# EAGLE design logger (EAGLE 6.4)
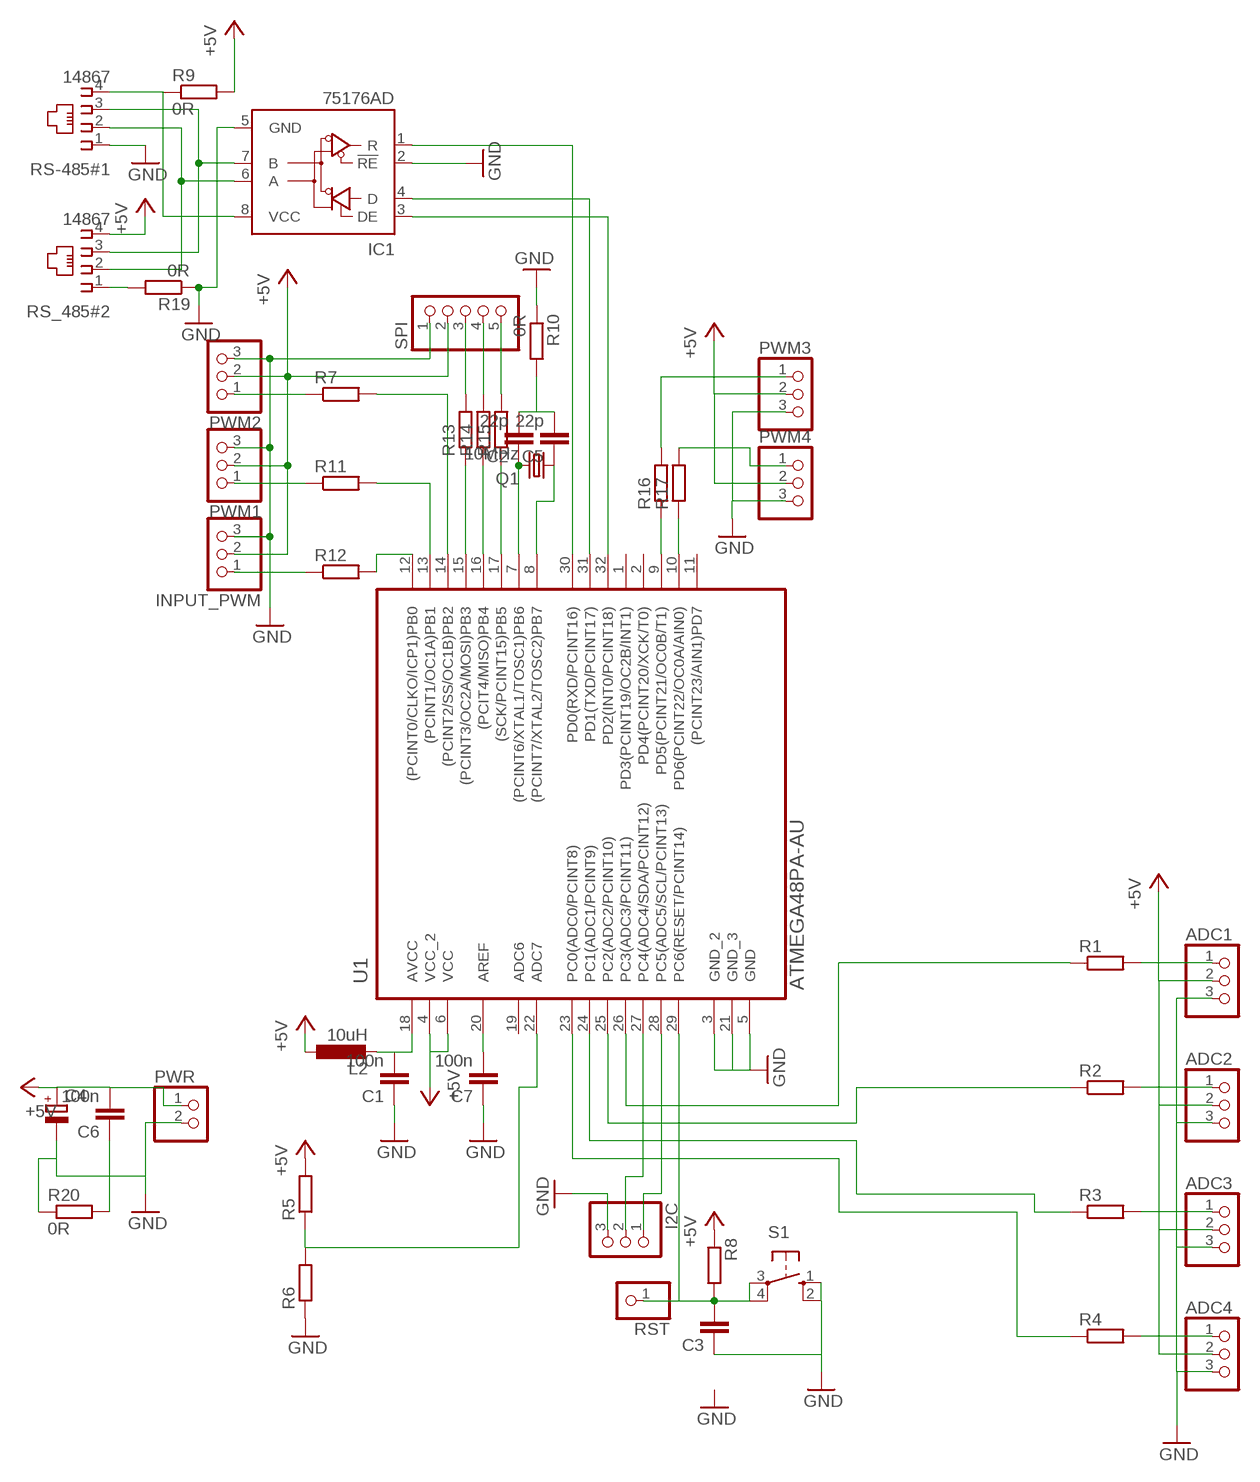
[diagram p0: schematic, sheet 1]

## Parts
ADC1  PINHD-1X3  [1X03]
ADC2  PINHD-1X3  [1X03]
ADC3  PINHD-1X3  [1X03]
ADC4  PINHD-1X3  [1X03]
C1  100n  C-EUC0805  [C0805]
C2  22p  C-EUC0805  [C0805]
C3  C-EUC0805  [C0805]
C4  CPOL-EUE2,5-6E  [E2,5-6E]
C5  22p  C-EUC0805  [C0805]
C6  100n  C-EUC0805  [C0805]
C7  100n  C-EUC0805  [C0805]
I2C  PINHD-1X3  [1X03]
IC1  75176AD  [D_R-PDSO-G8]
INPUT_PWM  PINHD-1X3  [1X03]
L2  10uH  L-EU  [L1206]
PWM1  PINHD-1X3  [1X03]
PWM2  PINHD-1X3  [1X03]
PWM3  PINHD-1X3  [1X03]
PWM4  PINHD-1X3  [1X03]
PWR  PINHD-1X2  [1X02]
Q1  10MHz  CRYSTALHC49U-V  [HC49U-V]
R1  R-EU_R0805  [R0805]
R2  R-EU_R0805  [R0805]
R3  R-EU_R0805  [R0805]
R4  R-EU_R0805  [R0805]
R5  R-EU_R0805  [R0805]
R6  R-EU_R1206  [R1206]
R7  R-EU_R0805  [R0805]
R8  R-EU_R0805  [R0805]
R9  0R  R-EU_R1206  [R1206]
R10  0R  R-EU_R1206  [R1206]
R11  R-EU_R0805  [R0805]
R12  R-EU_R0805  [R0805]
R13  R-EU_R0805  [R0805]
R14  R-EU_R0805  [R0805]
R15  R-EU_R0805  [R0805]
R16  R-EU_R0805  [R0805]
R17  R-EU_R0805  [R0805]
R19  0R  R-EU_R1206  [R1206]
R20  0R  R-EU_R1206  [R1206]
RS-485#1  14867  [14867]
RS_485#2  14867  [14867]
RST  PINHD-1X1  [1X01]
S1  10-XX  [B3F-10XX]
SPI  PINHD-1X5  [1X05]
U1  ATMEGA48PA-AU  [QFP80P900X900X120-32N]

## Nets
+5V: ADC1.2 ADC2.2 ADC3.2 ADC4.2 C4.+ C6.2 INPUT_PWM.2 L2.1 PWM1.2 PWM2.2 PWM3.2 PWM4.2 PWR.1 R5.2 R8.1 R9.2 RS_485#2.4 SPI.2 U1.4(VCC_2) U1.6(VCC)
DE: IC1.3(DE) U1.32(PD2(INT0/PCINT18))
GND: ADC1.3 ADC2.3 ADC3.3 ADC4.3 C1.1 C3.1 C4.- C6.1 C7.1 I2C.3 IC1.2(!RE) IC1.5(GND) INPUT_PWM.3 PWM1.3 PWM2.3 PWM3.3 PWM4.3 PWR.2 R6.1 R10.1 R19.1 R20.1 R20.2 RS-485#1.1 S1.1(S) S1.2(S1) SPI.1 U1.3(GND_2) U1.5(GND) U1.21(GND_3)
N$1: IC1.6(A) RS-485#1.2 RS_485#2.2
N$2: IC1.7(B) RS-485#1.3 RS_485#2.3
N$3: R5.1 R6.2 U1.22(ADC7)
N$4: R4.1 U1.23(PC0(ADC0/PCINT8))
N$5: ADC4.1 R4.2
N$6: ADC3.1 R3.2
N$7: ADC2.1 R2.2
N$8: ADC1.1 R1.2
N$9: R3.1 U1.24(PC1(ADC1/PCINT9))
N$10: R2.1 U1.25(PC2(ADC2/PCINT10))
N$11: R1.1 U1.26(PC3(ADC3/PCINT11))
N$12: INPUT_PWM.1 R12.1
N$13: R15.2 SPI.5
N$14: R14.2 SPI.4
N$15: C3.2 R8.2 RST.1 S1.3(P) S1.4(P1) U1.29(PC6(RESET/PCINT14))
N$16: C2.1 Q1.2 U1.7((PCINT6/XTAL1/TOSC1)PB6)
N$17: R13.2 SPI.3
N$18: C5.1 Q1.1 U1.8((PCINT7/XTAL2/TOSC2)PB7)
N$19: C1.2 L2.2 U1.18(AVCC)
N$20: IC1.8(VCC) R9.1 RS-485#1.4
N$21: I2C.1 U1.28(PC5(ADC5/SCL/PCINT13))
N$22: I2C.2 U1.27(PC4(ADC4/SDA/PCINT12))
N$23: PWM1.1 R11.1
N$24: PWM2.1 R7.1
N$25: R13.1 U1.15((PCINT3/OC2A/MOSI)PB3)
N$26: R14.1 U1.16((PCIT4/MISO)PB4)
N$27: R16.1 U1.9(PD5(PCINT21/OC0B/T1))
N$28: R17.1 U1.10(PD6(PCINT22/OC0A/AIN0))
N$29: R15.1 U1.17((SCK/PCINT15)PB5)
N$30: R19.2 RS_485#2.1
N$31: R12.2 U1.12((PCINT0/CLKO/ICP1)PB0)
N$32: R11.2 U1.13((PCINT1/OC1A)PB1)
N$33: R7.2 U1.14((PCINT2/SS/OC1B)PB2)
N$34: C7.2 U1.20(AREF)
N$35: C2.2 C5.2 R10.2
N$36: PWM4.1 R17.2
N$37: PWM3.1 R16.2
RX: IC1.1(R) U1.30(PD0(RXD/PCINT16))
TX: IC1.4(D) U1.31(PD1(TXD/PCINT17))
Unconnected: U1.1(PD3(PCINT19/OC2B/INT1)) U1.2(PD4(PCINT20/XCK/T0)) U1.11((PCINT23/AIN1)PD7) U1.19(ADC6)

## Library data of the parts
ADC1-ADC4 I2C INPUT_PWM PWM1-PWM4 = pinhead:PINHD-1X3: PIN HEADER
C1-C3 C5-C7 = rcl:C-EU: CAPACITOR, European symbol
C4 = rcl:CPOL-EU: POLARIZED CAPACITOR, European symbol
IC1 = 751xx:75176A: DIFFERENTIAL BUS TRANSCEIVER Source: http://focus.ti.com/lit/ds/symlink/sn75176a.pdf
L2 = rcl:L-EU: INDUCTOR, European symbol
PWR = pinhead:PINHD-1X2: PIN HEADER
Q1 = crystal:CRYSTAL: CRYSTAL; OC_FARNELL: 1666969; OC_NEWARK: unknown
R1-R17 R19 R20 = rcl:R-EU_: RESISTOR, European symbol
RS-485#1 RS_485#2 = con-4ucon:14867: RJ11 Connector Source: 4UCON TECHNOLOGY INC. 14867.pdf; OC_FARNELL: unknown; OC_NEWARK: unknown
RST = pinhead:PINHD-1X1: PIN HEADER
S1 = switch-omron:10-XX: OMRON SWITCH; MPN: B3F-1000; OC_FARNELL: 176432; OC_NEWARK: 36M3542
SPI = pinhead:PINHD-1X5: PIN HEADER
U1 = atmega48PA:ATMEGA48PA-AU: Microcontroller with Programmable Flash; MPN: ATMEGA48PA-AU; OC_FARNELL: 1715488; OC_NEWARK: 15R0269; PACKAGE: TQFP-32; SUPPLIER: Atmel

## Board
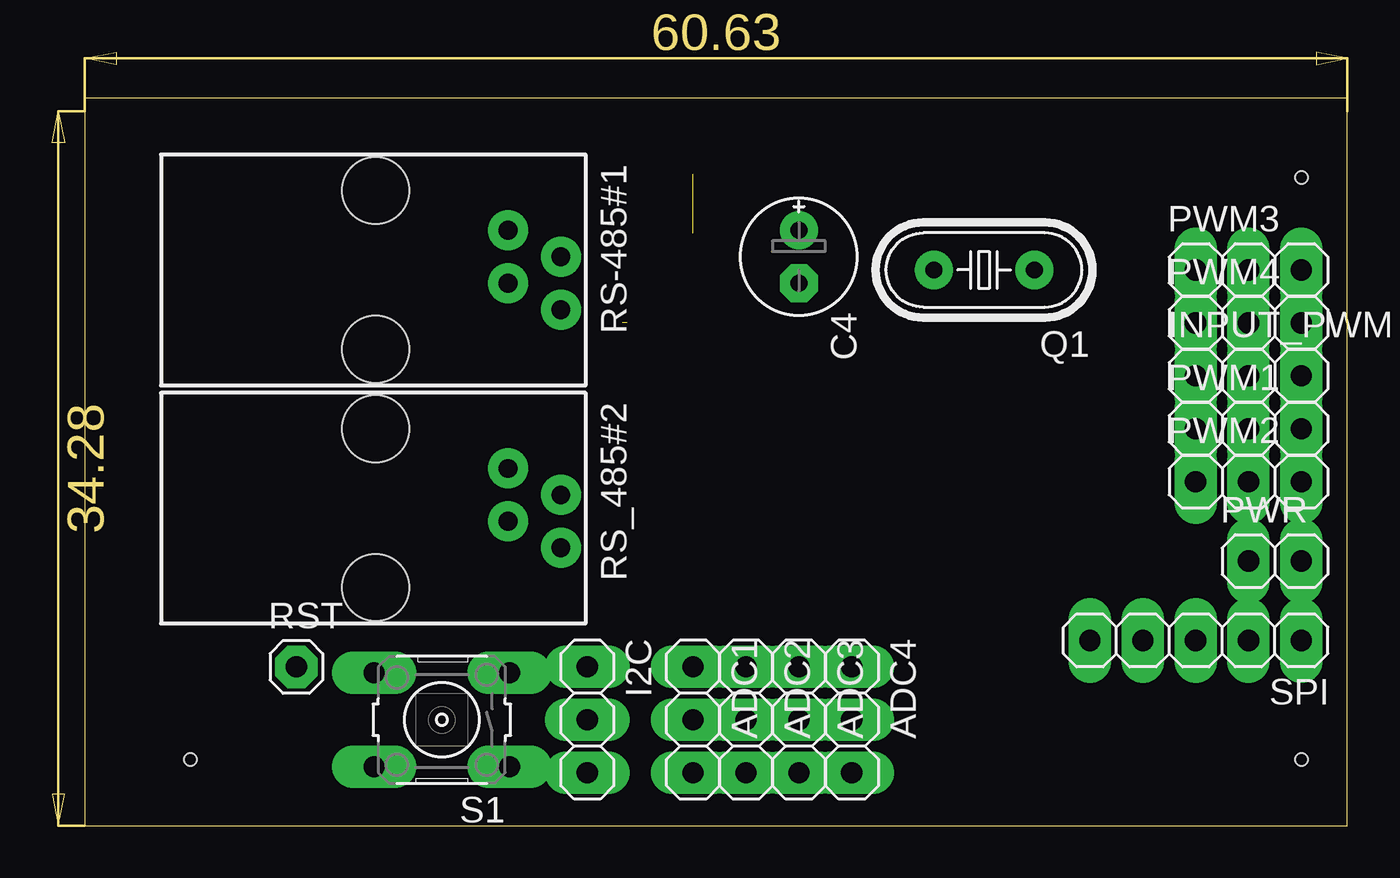
[diagram p1: board, top side]
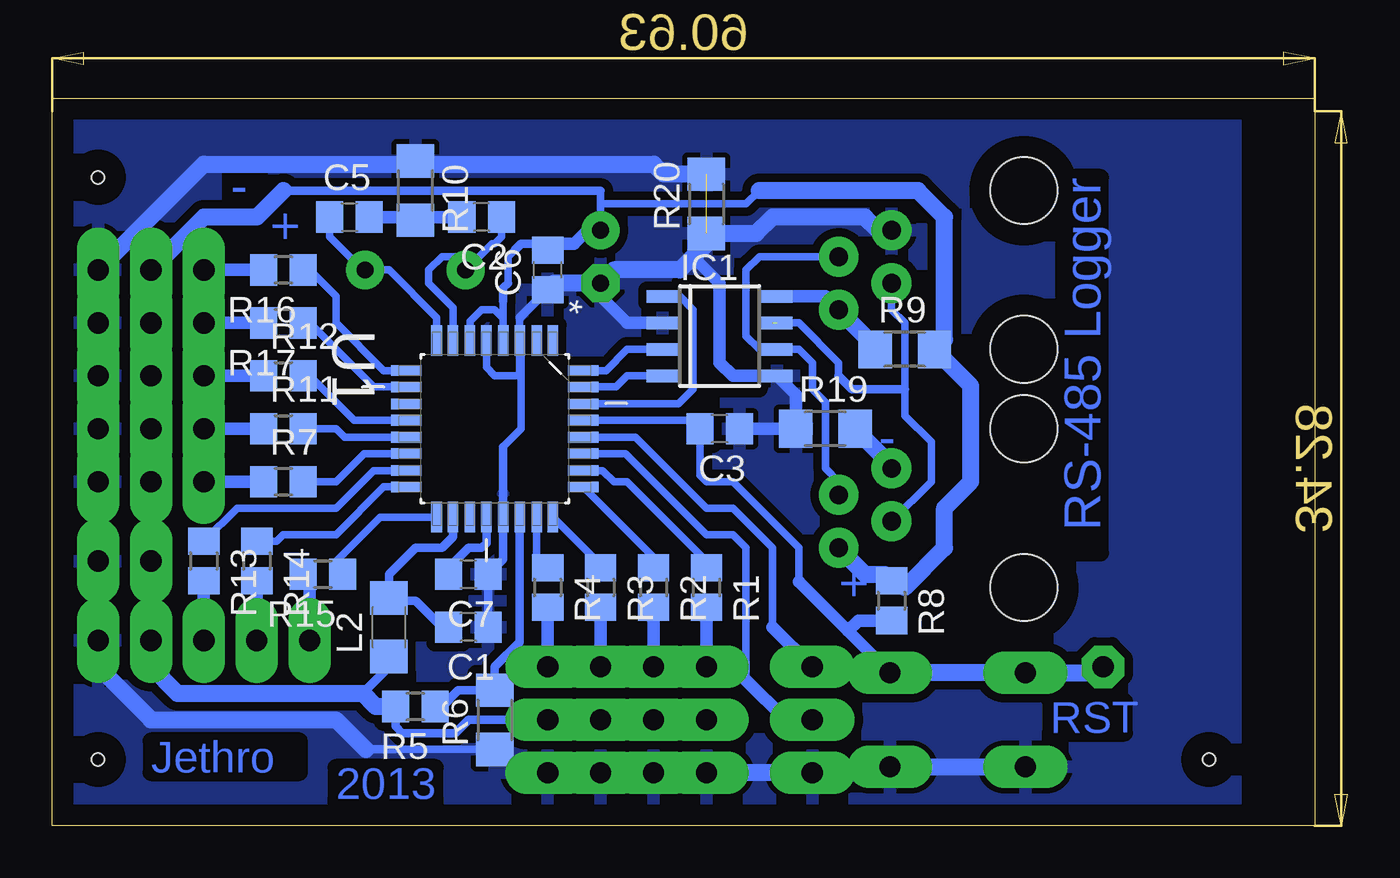
[diagram p2: board, bottom side, seen from below]

Size 60.63 x 34.92 mm. Coordinates in mm from the lower left corner, seen from the top.
Outline: 0,0 60.63,0 60.63,34.92 0,34.92 0,0
Copper layers (1*16): Top 0.035mm / dielectric 1.5mm / Bottom 0.035mm
Design rules "default *": minimum track width 10mil, minimum drill 24mil, track to track 8mil, track to pad 8mil, pad to pad 8mil, via to via 8mil, smd to smd 8mil, copper to edge 40mil, drill to drill 8mil, minimum pad ring 20mil, minimum via ring 15mil, stop-mask expansion 4mil, vias tented up to drill 0mil, thermal gap 10mil
Holes 0.6 mm at 68.58,31.11 5.08,3.17 58.42,3.17 58.42,31.11
bRestrict: area 26.7,21 to 30.5,26; area 36.8,16.5 to 41.9,22.9

### Footprints (pad centres in the part's own frame; a part is rotated, then mirrored left to right if it is on the bottom)
1X03 = drill 1.016 long: 1 -2.54,0; 2 0,0; 3 2.54,0
C0805 = smd 1.3 x 1.5: 1 -0.95,0; 2 0.95,0
E2,5-6E = drill 0.813 pad 1.575: + -1.27,0 | drill 0.813 pad 1.575 octagon: - 1.27,0
D_R-PDSO-G8 = smd 0.6 x 1.5: 1 -1.905,-2.75; 2 -0.635,-2.75; 3 0.635,-2.75; 4 1.905,-2.75; 5 1.905,2.75; 6 0.635,2.75; 7 -0.635,2.75; 8 -1.905,2.75
L1206 = smd 1.6 x 1.8: 1 -1.4,0; 2 1.4,0
1X02 = drill 1.016 long: 1 -1.27,0; 2 1.27,0
HC49U-V = drill 0.813: 1 -2.413,0; 2 2.413,0
R0805 = smd 1.3 x 1.5: 1 -0.95,0; 2 0.95,0
R1206 = smd 1.6 x 1.803: 1 -1.422,0; 2 1.422,0
14867 = drill 0.9 pad 1.422: 1 -1.905,6.35; 2 -0.635,8.89; 3 0.635,6.35; 4 1.905,8.89 | hole 3.2: -3.81,0; 3.81,0
1X01 = drill 1.016 octagon: 1 0,0
B3F-10XX = drill 1.016 long: 1 -3.251,2.261; 2 3.251,2.261; 3 -3.251,-2.261; 4 3.251,-2.261
1X05 = drill 1.016 long: 1 -5.08,0; 2 -2.54,0; 3 0,0; 4 2.54,0; 5 5.08,0
QFP80P900X900X120-32N = smd 1.473 x 0.508: 1 -4.242,2.794; 2 -4.242,2.007; 3 -4.242,1.194; 4 -4.242,0.406; 5 -4.242,-0.406; 6 -4.242,-1.194; 7 -4.242,-2.007; 8 -4.242,-2.794; 17 4.242,-2.794; 18 4.242,-2.007; 19 4.242,-1.194; 20 4.242,-0.406; 21 4.242,0.406; 22 4.242,1.194; 23 4.242,2.007; 24 4.242,2.794 | smd 0.508 x 1.473: 9 -2.794,-4.242; 10 -2.007,-4.242; 11 -1.194,-4.242; 12 -0.406,-4.242; 13 0.406,-4.242; 14 1.194,-4.242; 15 2.007,-4.242; 16 2.794,-4.242; 25 2.794,4.242; 26 2.007,4.242; 27 1.194,4.242; 28 0.406,4.242; 29 -0.406,4.242; 30 -1.194,4.242; 31 -2.007,4.242; 32 -2.794,4.242

### Placement (x,y rotation side)
ADC1  29.21,5.08 270 top
ADC2  31.75,5.08 270 top
ADC3  34.29,5.08 270 top
ADC4  36.83,5.08 270 top
C1  40.64,9.52 180 bottom
C2  40,29.21 180 bottom
C3  28.57,19.05 180 bottom
C4  34.29,27.3 270 top
C5  46.36,29.21 0 bottom
C6  36.83,26.67 90 bottom
C7  40.64,12.06 180 bottom
I2C  24.13,5.08 270 top
IC1  28.57,23.5 270 bottom
INPUT_PWM  55.88,21.59 0 top
L2  44.45,9.52 90 bottom
PWM1  55.88,19.05 0 top
PWM2  55.88,16.51 0 top
PWM3  55.88,26.67 0 top
PWM4  55.88,24.13 0 top
PWR  57.15,12.7 0 top
Q1  43.18,26.67 180 top
R1  29.21,11.43 270 bottom
R2  31.75,11.43 270 bottom
R3  34.29,11.43 270 bottom
R4  36.83,11.43 270 bottom
R5  43.18,5.71 180 bottom
R6  39.37,5.08 90 bottom
R7  49.53,16.51 0 bottom
R8  20.32,10.8 270 bottom
R9  19.68,22.86 0 bottom
R10  43.18,30.48 270 bottom
R11  49.53,19.05 0 bottom
R12  49.53,21.59 0 bottom
R13  53.34,12.7 270 bottom
R14  50.8,12.7 270 bottom
R15  47.62,12.06 180 bottom
R16  49.53,26.67 180 bottom
R17  49.53,24.13 180 bottom
R19  23.5,19.05 0 bottom
R20  29.21,29.84 90 bottom
RS-485#1  13.97,26.67 270 top
RS_485#2  13.97,15.24 270 top
RST  10.16,7.62 0 top
S1  17.14,5.08 180 top
SPI  53.34,8.89 180 top
U1  39.37,19.05 270 bottom

### Tracks (layer width: path | path; a pad name or v marks a point on that pad's centre or on a via)
+5V
  Bottom 0.358: U1.6 40.56,24.21 40,24.77 39.37,24.77 38.96,24.36 U1.4 38.96,25.17 | 38.42,27.62 38.73,27.3 38.73,26.03 | 19.68,11.43 20,11.43 R8.1 20.64,12.06 | C4.+ 34.29,29.84 | 34.29,29.84 34.29,30.48 | 26.67,30.48 27.3,29.84 34.29,29.84
  Bottom 0.406: 36.51,27.94 36.83,27.94 | 36.83,27.94 38.1,27.94 38.42,27.62 | 38.96,25.17 38.96,25.81 38.73,26.03 | C6.2 36.83,27.94 | ADC4.2 40.64,5.08 41.28,4.45 43.81,4.45 44.13,4.76 R5.2 | 34.29,30.48 49.53,30.48 | L2.1 44.45,7.62 45.72,6.35
  Bottom 0.61: 36.51,27.94 35.56,27.94 34.92,28.58 C4.+
  Bottom 0.813: ADC1.2 ADC2.2 ADC3.2 ADC4.2 | RS_485#2.4 21.59,12.06 20.64,12.06 | 19.68,11.43 17.78,13.34 17.78,15.24 16.51,16.51 16.51,21.11 R9.2 17.78,23.34 17.78,29.21 19.05,30.48 26.67,30.48 | R5.2 45.09,5.71 45.72,6.35 54.61,6.35 55.88,7.62 SPI.2 PWR.1 PWM2.2 PWM1.2 INPUT_PWM.2 PWM4.2 PWM3.2 53.34,29.21 50.8,29.21 49.53,30.48
DE
  Bottom 0.358: U1.32 34.04,21.84 33.02,22.86 IC1.3
GND  (1 unrouted)
  Bottom 0.358: U1.21 38.96,18.19 38.1,19.05 38.1,21.59 | 38.1,21.59 38.1,23.22 U1.3 | ADC4.3 38.25,2.54 R6.1 44.17,3.66 | U1.3 38.18,21.67 38.1,21.59 | 38.1,21.59 39.37,21.59 39.78,22 U1.5 | U1.3 38.18,24.37 | 20.68,2.54 S1.1 | R20.1 29.21,27.94 | 43.03,31.75 R10.1 43.18,31.75
  Bottom 0.406: C4.- 34.29,25.4 | 38.18,24.37 C6.1 36.52,26.03 | 44.17,3.66 45.57,3.66 | 38.96,18.19 38.96,12.79 C7.1 C1.1
  Bottom 0.61: C3.1 R19.1 24.92,20.68 IC1.5 27.94,21.59 28.57,22.23 28.57,26.03 29.84,27.3 | 34.29,25.4 33.02,24.13 IC1.2
  Bottom 0.813: S1.2 S1.1 19.41,2.54 | ADC4.3 ADC3.3 ADC2.3 ADC1.3 I2C.3 20.68,2.54 | 36.52,26.03 C4.- 33.66,26.67 30.48,26.67 29.84,27.3 29.21,27.94 | 43.18,31.75 53.34,31.75 PWM3.3 PWM4.3 INPUT_PWM.3 PWM1.3 PWM2.3 PWR.2 SPI.1 58.42,7.62 55.88,5.08 46.99,5.08 45.57,3.66 | RS-485#1.1 20.96,28.58 21.59,29.21 26.04,29.21 26.82,28.42 R20.1 | 43.03,31.75 31.75,31.75 31.27,31.27 R20.2
  pour Bottom (isolate 0.406): 5.08,34.29 60.33,34.29 60.33,0 3.81,0 3.81,34.29
N$1
  Bottom 0.358: RS_485#2.2 22.86,16.51 23.5,17.14 23.5,20.32 24.13,20.95 24.13,22.23 24.76,22.86 IC1.6 26.67,22.86 27.3,23.5 27.3,26.67 26.67,27.3 RS-485#1.2
N$2  (1 unrouted)
  Bottom 0.358: RS-485#1.3 20.32,24.77 19.68,24.13 19.68,20.95 19.68,19.69 18.41,18.41 18.41,16.51 RS_485#2.3 | 26.04,24.13 24.76,24.13 22.86,22.23 22.86,21.59
  Bottom 0.406: 22.86,21.59 22.22,20.95 19.68,20.95
N$3
  Bottom 0.406: R5.1 41.91,5.71 41.12,6.5 R6.2 39.37,7.62 38.18,8.81 U1.22
N$4
  Bottom 0.358: U1.23 37.36,12.91 R4.1
N$5
  Bottom 0.61: ADC4.1 R4.2
N$6
  Bottom 0.61: ADC3.1 R3.2
N$7
  Bottom 0.61: ADC2.1 R2.2
N$8
  Bottom 0.61: ADC1.1 R1.2
N$9
  Bottom 0.358: R3.1 34.29,12.52 U1.24
N$10
  Bottom 0.358: R2.1 31.75,12.88 U1.25
N$11
  Bottom 0.358: U1.26 34.19,17.04 33.66,16.51 33.02,16.51 29.21,12.7 R1.1
N$12
  Bottom 0.61: INPUT_PWM.1 R12.1
N$13
  Bottom 0.358: 48.26,11.75 R15.2
  Bottom 0.61: SPI.5 48.26,11.75
N$14
  Bottom 0.61: SPI.4 R14.2
N$15
  Bottom 0.358: U1.29 29.93,19.46 C3.2 29.53,16.83 29.21,16.51 27.94,16.51 24.76,13.34 24.76,11.71
  Bottom 0.61: 24.76,11.71 22.4,9.35 | 22.4,9.35 S1.3 | R8.2 21.9,9.84 22.4,9.35
  Bottom 0.813: S1.3 S1.4 10.44,7.34 RST.1
N$16
  Bottom 0.358: U1.7 41.38,24.87 42.55,26.03 42.55,26.67 41.91,27.3 41.28,27.3 41.28,27.18 Q1.2 39.5,27.94 39.37,27.94 39.06,28.25 C2.1
N$17
  Bottom 0.61: SPI.3 R13.2
N$18
  Bottom 0.358: U1.8 42.16,24.38 44.45,26.67 Q1.1 45.72,26.67 47.31,28.25 C5.1
N$19
  Bottom 0.406: U1.18 41.38,13.87 41.91,13.34 43.18,13.34 44.45,12.06 L2.2 44.32,10.8 43.18,10.8 41.91,9.52 C1.2
N$20
  Bottom 0.358: 23.5,25.4 RS-485#1.4 | R9.1 21.11,23.01
  Bottom 0.61: IC1.8 23.5,25.4
  Bottom 0.813: 21.11,23.01 RS-485#1.4
N$21
  Bottom 0.358: U1.28 32.61,18.64 29.21,15.24 27.94,15.24 26.04,13.34 26.04,9.52
  Bottom 0.61: 26.04,9.52 I2C.1
N$22
  Bottom 0.358: U1.27 33.1,17.86 29.21,13.97 27.94,13.97 27.3,13.34 27.3,6.98
  Bottom 0.61: I2C.2 25.4,5.08 27.3,6.98
N$23
  Bottom 0.61: PWM1.1 R11.1
N$24
  Bottom 0.61: PWM2.1 R7.1
N$25
  Bottom 0.358: U1.15 45.19,17.04 46.99,15.24 51.75,15.24 R13.1
N$26
  Bottom 0.358: R14.1 49.85,13.65 49.53,13.97 46.99,13.97 44.7,16.26 U1.16
N$27
  Bottom 0.358: U1.9 44.7,21.84 46.99,24.13 46.99,25.4 48.26,26.67 R16.1
N$28
  Bottom 0.358: U1.10 45.19,21.06 48.26,24.13 R17.1
N$29
  Bottom 0.358: U1.17 44.88,14.81 46.99,12.7 46.99,12.38 R15.1
N$30
  Bottom 0.813: RS_485#2.1 20.32,17.3 R19.2
N$31
  Bottom 0.358: U1.12 46.13,19.46 48.26,21.59 R12.2
N$32
  Bottom 0.358: U1.13 46.58,18.64 46.99,19.05 R11.2
N$33
  Bottom 0.358: U1.14 45.64,17.86 46.99,16.51 R7.2
N$34
  Bottom 0.406: U1.20 39.78,13.56 40,13.34 40.64,13.34 41.28,12.7 41.28,12.38 C7.2
N$35
  Bottom 0.358: C2.2 43.03,29.21
  Bottom 0.61: 43.03,29.21 R10.2 | C2.2 C5.2
N$36
  Bottom 0.61: R17.2 PWM4.1
N$37
  Bottom 0.61: PWM3.1 R16.2
RX
  Bottom 0.358: IC1.1 30.48,25.4 29.84,24.77 29.84,20.95 30.56,20.24 U1.30
TX
  Bottom 0.358: U1.31 33.55,21.06 33.02,21.59 IC1.4

### Text on the board
Bottom: RS-485 Logger | - | + | - | + | RST | Jethro | 2013